# EAGLE design Power_Monitoring_Schematic (EAGLE 9.0.0)
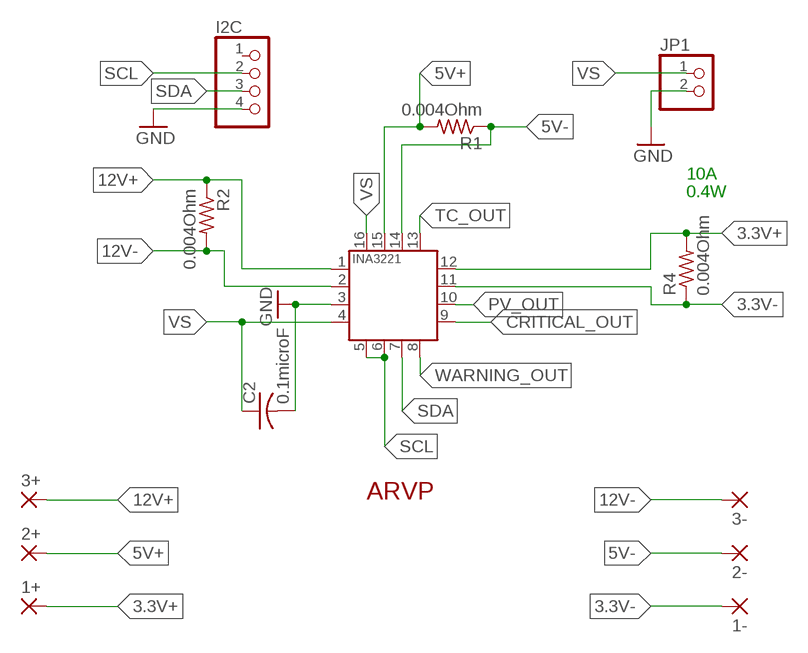
[diagram p0: schematic, sheet 1]

## Parts
1+  3,81/1,5A  [3,81/1,5]
1-  3,81/1,5A  [3,81/1,5]
2+  3,81/1,5A  [3,81/1,5]
2-  3,81/1,5A  [3,81/1,5]
3+  3,81/1,5A  [3,81/1,5]
3-  3,81/1,5A  [3,81/1,5]
ARVP1  ARVP_LOGO  [ARVP]
C2  0.1microF  C-USC2012  [C2012]
I2C  PINHD-1X4  [1X04]
JP1  PINHD-1X2  [1X02]
R1  0.004Ohm  R-US_R1206  [R1206]
R2  0.004Ohm  R-US_R1206  [R1206]
R4  0.004Ohm  R-US_R1206  [R1206]
U1  INA3221.  [HVQFN16_4X4]

## Nets
3.3V+: 1+.1(P) R4.2 U1.12(IN+1)
3.3V-: 1-.1(P) R4.1 U1.11(IN-1)
5V+: 2+.1(P) R1.2 U1.15(IN+2)
5V-: 2-.1(P) R1.1 U1.14(IN-2)
12V+: 3+.1(P) R2.1 U1.1(IN-3)
12V-: 3-.1(P) R2.2 U1.2(IN+3)
CRITICAL_OUT: U1.9(CRITICAL)
GND: C2.2 I2C.4 JP1.2 U1.3(GND)
PV_OUT: U1.10(PV)
SCL: I2C.2 U1.5(A0) U1.6(SCL)
SDA: I2C.3 U1.7(SDA)
TC_OUT: U1.13(TC)
VS: C2.1 JP1.1 U1.4(VS) U1.16(VPU)
WARNING_OUT: U1.8(WARNING)
Unconnected: I2C.1

## Notes on the sheet
- 10A
- 0.4W

## Library data of the parts
1+ 1- 2+ 2- 3+ 3- = Moira:3,81/1,5: THROUGH-HOLE PAD
ARVP1 = ARVP:ARVP_LOGO
C2 = resistor:C-US: CAPACITOR, American symbol
I2C = pinhead:PINHD-1X4: PIN HEADER
JP1 = pinhead:PINHD-1X2: PIN HEADER
R1 R2 R4 = adafruit:R-US_: RESISTOR, American symbol
U1 = INA3221:INA3221: The INA3221 is a three-channel, high-side current and bus voltage monitor with an I 2C- and SMBUScompatible interface. The INA3221 monitors both shunt voltage drops and bus supply voltages, in addition to having programmable conversion times and averaging modes for these signals. The INA3221 offers both critical and warning alerts to detect multiple programmable out-of-range conditions for each channel.

## Net classes
1 net1: clearance 0.203 mm to class 0

## Board
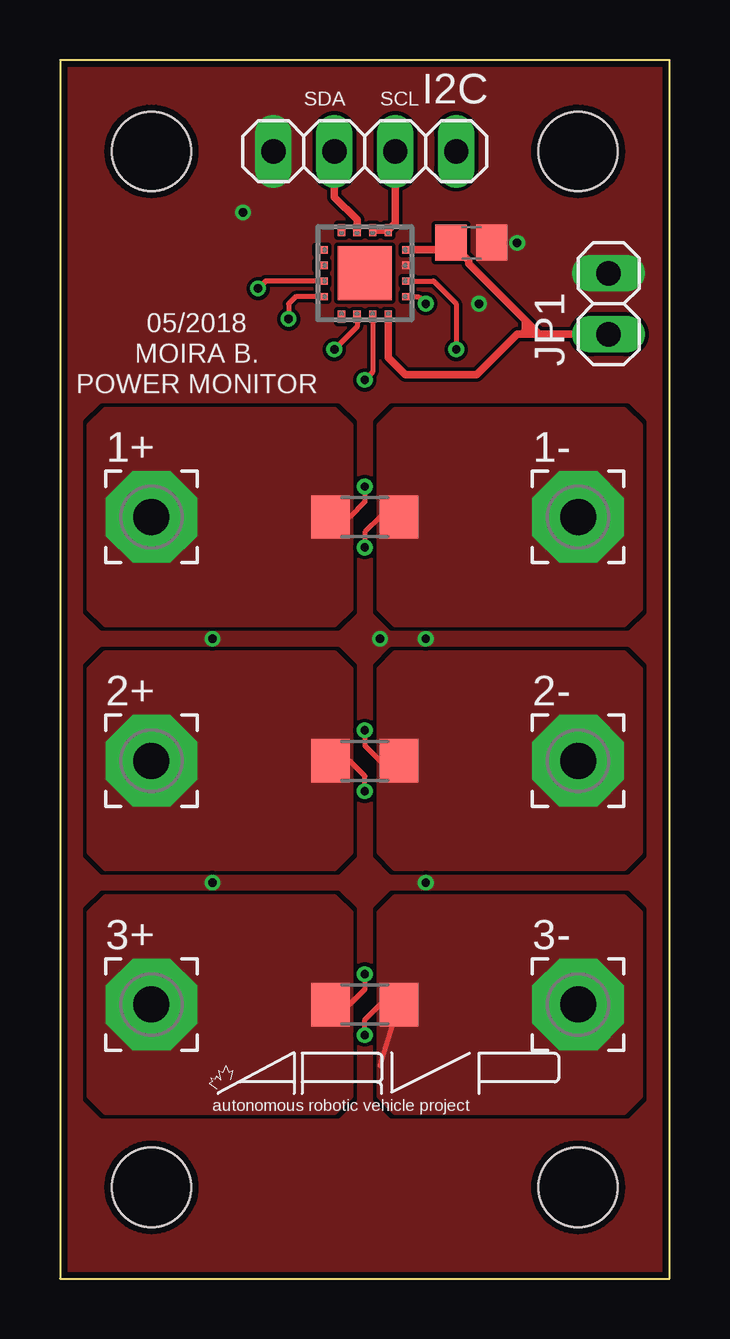
[diagram p1: board, top side]
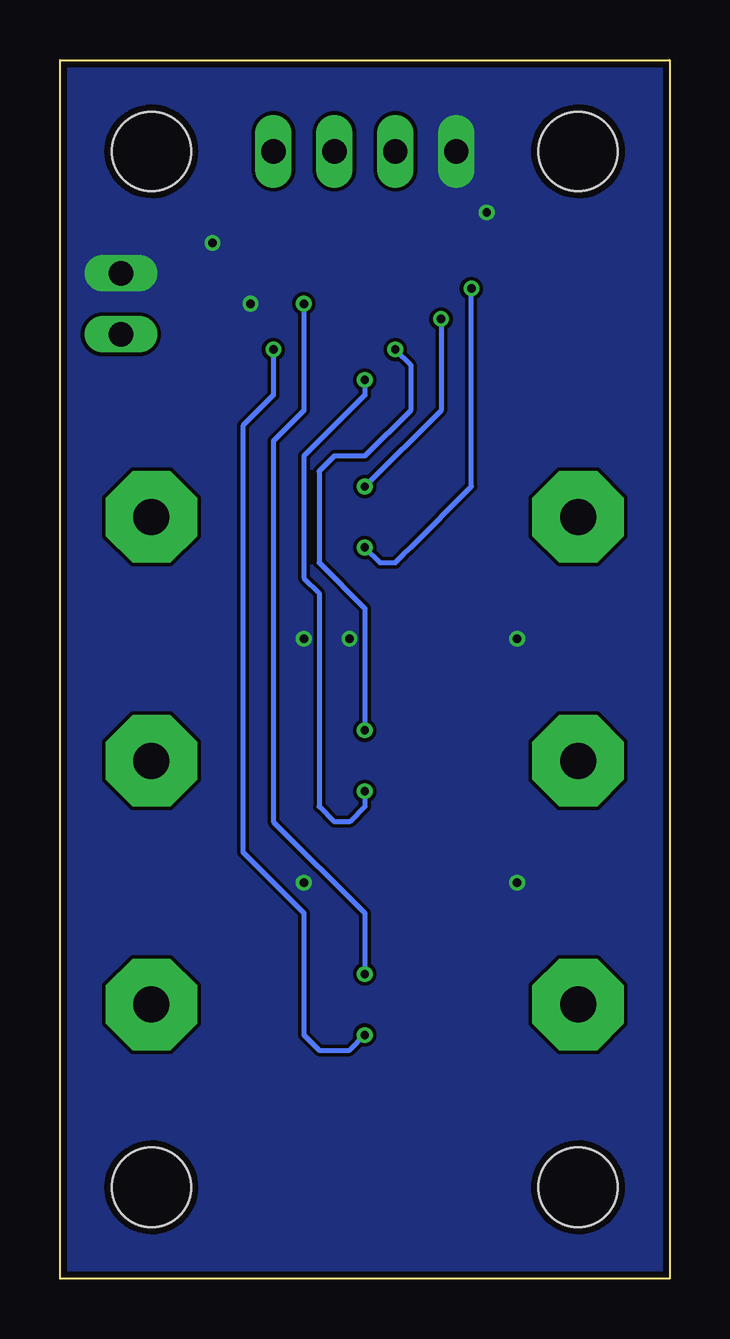
[diagram p2: board, bottom side, seen from below]

Size 25.4 x 50.8 mm. Coordinates in mm from the lower left corner, seen from the top.
Outline: 25.4,0 25.4,50.8 0,50.8 0,0 25.4,0
Copper layers (1*16): Top 0.035mm / dielectric 1.5mm / Bottom 0.035mm
Design rules "JLCPCB2Layer": minimum track width 6mil, minimum drill 10mil, track to track 6mil, track to pad 6mil, pad to pad 6mil, via to via 6mil, smd to smd 0mil, copper to edge 10mil, drill to drill 10mil, minimum pad ring 6mil, minimum via ring 6mil, stop-mask expansion 2mil, vias tented up to drill 100mil, thermal gap 10mil
Milling: 4 lines

### Footprints (pad centres in the part's own frame; a part is rotated, then mirrored left to right if it is on the bottom)
3,81/1,5 = drill 1.5 pad 3.81 octagon: 1 0,0
C2012 = smd 1.3 x 1.5: 1 -0.85,0; 2 0.85,0
1X04 = drill 1.016 long: 1 -3.81,0; 2 -1.27,0; 3 1.27,0; 4 3.81,0
1X02 = drill 1.016 long: 1 -1.27,0; 2 1.27,0
R1206 = smd 1.6 x 1.803: 1 -1.422,0; 2 1.422,0
HVQFN16_4X4 = smd 0.5 x 0.3: 1 -1.8,0.975; 2 -1.8,0.325; 3 -1.8,-0.325; 4 -1.8,-0.975; 9 1.8,-0.975; 10 1.8,-0.325; 11 1.8,0.325; 12 1.8,0.975 | smd 0.3 x 0.5: 5 -0.975,-1.8; 6 -0.325,-1.8; 7 0.325,-1.8; 8 0.975,-1.8; 13 0.975,1.8; 14 0.325,1.8; 15 -0.325,1.8; 16 -0.975,1.8 | smd 2.25 x 2.25: TH 0,0
STAND-OFF = hole 3.302: 0,0

### Placement (x,y rotation side)
1+  3.81,31.75 0 top
1-  21.59,31.75 0 top
2+  3.81,21.59 0 top
2-  21.59,21.59 0 top
3+  3.81,11.43 0 top
3-  21.59,11.43 0 top
ARVP1  6.35,6.98 0 top
C2  17.14,43.18 0 top
I2C  12.7,46.99 180 top
JP1  22.86,40.64 90 top
R1  12.7,21.59 180 top
R2  12.7,11.43 0 top
R4  12.7,31.75 180 top
U1  12.7,41.91 180 top
U$1  [STAND-OFF]  21.59,3.81 0 top
U$2  [STAND-OFF]  3.81,3.81 0 top
U$3  [STAND-OFF]  3.81,46.99 0 top
U$4  [STAND-OFF]  21.59,46.99 0 top

### Tracks (layer width: path | path; a pad name or v marks a point on that pad's centre or on a via)
3.3V+  (via drill 0.35)
  Top 0.2: U1.12 9.82,40.94 9.52,40.64 v9.52,40 | v12.7,33.02 12.7,32.38 12.06,31.75 R4.2
  Bottom 0.2: v9.52,40 9.52,36.2 v12.7,33.02
  pour Top (no thermals): 12.06,35.56 12.06,27.94 11.43,27.3 1.9,27.3 1.27,27.94 1.27,35.56 1.9,36.2 11.43,36.2
3.3V-  (via drill 0.35)
  Top 0.2: U1.11 8.56,41.58 v8.25,41.27 | R4.1 13.33,31.75 12.7,31.11 v12.7,30.48
  Bottom 0.2: v12.7,30.48 12.06,29.84 11.43,29.84 11.11,30.16 10.79,30.48 8.25,33.02 v8.25,41.27
  pour Top (no thermals): 24.13,35.56 24.13,27.94 23.49,27.3 13.97,27.3 13.33,27.94 13.33,35.56 13.97,36.2 23.49,36.2
5V+  (via drill 0.35)
  Top 0.2: U1.15 13.02,37.79 v12.7,37.46 | R1.2 12.06,21.59 12.7,20.95 v12.7,20.32
  Bottom 0.2: v12.7,20.32 12.7,19.68 13.33,19.05 13.97,19.05 14.6,19.68 14.6,28.57 15.24,29.21 15.24,34.29 12.7,36.83 v12.7,37.46
  pour Top (no thermals): 12.06,25.4 12.06,17.78 11.43,17.14 1.9,17.14 1.27,17.78 1.27,25.4 1.9,26.04 11.43,26.04
5V-  (via drill 0.35)
  Top 0.2: U1.14 12.38,39.68 v11.43,38.73 | v12.7,22.86 12.7,22.22 13.33,21.59 R1.1
  Bottom 0.2: v11.43,38.73 10.79,38.1 10.79,36.2 12.7,34.29 13.97,34.29 14.6,33.66 14.6,29.84 12.7,27.94 v12.7,22.86
  pour Top (no thermals): 24.13,25.4 24.13,17.78 23.49,17.14 13.97,17.14 13.33,17.78 13.33,25.4 13.97,26.04 23.49,26.04
12V+  (via drill 0.35)
  Top 0.2: U1.1 14.95,40.94 v15.24,40.64 | v12.7,12.7 12.7,12.06 12.06,11.43 R2.1
  Bottom 0.2: v15.24,40.64 15.24,36.2 16.51,34.92 16.51,19.05 12.7,15.24 v12.7,12.7
  pour Top (no thermals): 12.06,15.24 12.06,7.62 11.43,6.98 1.9,6.98 1.27,7.62 1.27,15.24 1.9,15.87 11.43,15.87
12V-  (via drill 0.35)
  Top 0.2: U1.2 15.56,41.58 16.51,40.64 v16.51,38.73 | 13.33,8.89 14.11,11.39 | 14.11,11.39 R2.2 | 14.11,11.39 14.07,11.43 13.33,11.43 12.7,10.79 v12.7,10.16
  Bottom 0.2: v12.7,10.16 13.33,9.52 14.6,9.52 15.24,10.16 15.24,15.24 17.78,17.78 17.78,35.56 16.51,36.83 v16.51,38.73
  pour Top (no thermals): 24.13,15.24 24.13,7.62 23.49,6.98 13.97,6.98 13.33,7.62 13.33,15.24 13.97,15.87 23.49,15.87
GND  (via drill 0.35)
  other vias: 17.46,40.64 7.62,44.45 15.24,26.67 15.24,16.51 6.35,16.51 6.35,26.67 13.33,26.67 19.05,43.18
  pour Top (rank 2, no thermals): 0,50.8 25.4,50.8 25.4,0 0,0
  pour Bottom (rank 2, no thermals): 0,50.8 25.4,50.8 25.4,0 0,0
  pour Top (rank 2, no thermals): 0,50.8 25.4,50.8 25.4,0 0,0
SCL
  Top 0.305: I2C.2 13.97,44 U1.5 U1.6
SDA
  Top 0.305: U1.7 12.38,44.14 11.43,45.08 I2C.3
VS
  Top 0.305: U1.4 16,42.88 C2.1 17.04,42.44 17.04,42.3 19.39,39.95 | 19.54,39.8 19.97,39.37 | 19.97,39.37 JP1.1 | 19.97,39.37 19.54,39.37 | 19.54,39.37 19.39,39.37 | 19.39,39.37 19.23,39.37 | 19.39,39.95 19.39,39.37 | 19.39,39.95 19.51,39.83 | 19.51,39.83 19.54,39.8 | 19.54,39.8 19.54,39.37 | 19.51,39.83 19.51,39.65 19.23,39.37 | 19.23,39.37 19.05,39.37 17.37,37.69 14.38,37.69 13.67,38.39 U1.16

### Text on the board
tPlace: SDA | SCL
tNames: 05/2018 | MOIRA B. | POWER MONITOR